# EAGLE design Reader (EAGLE 8.1.0)
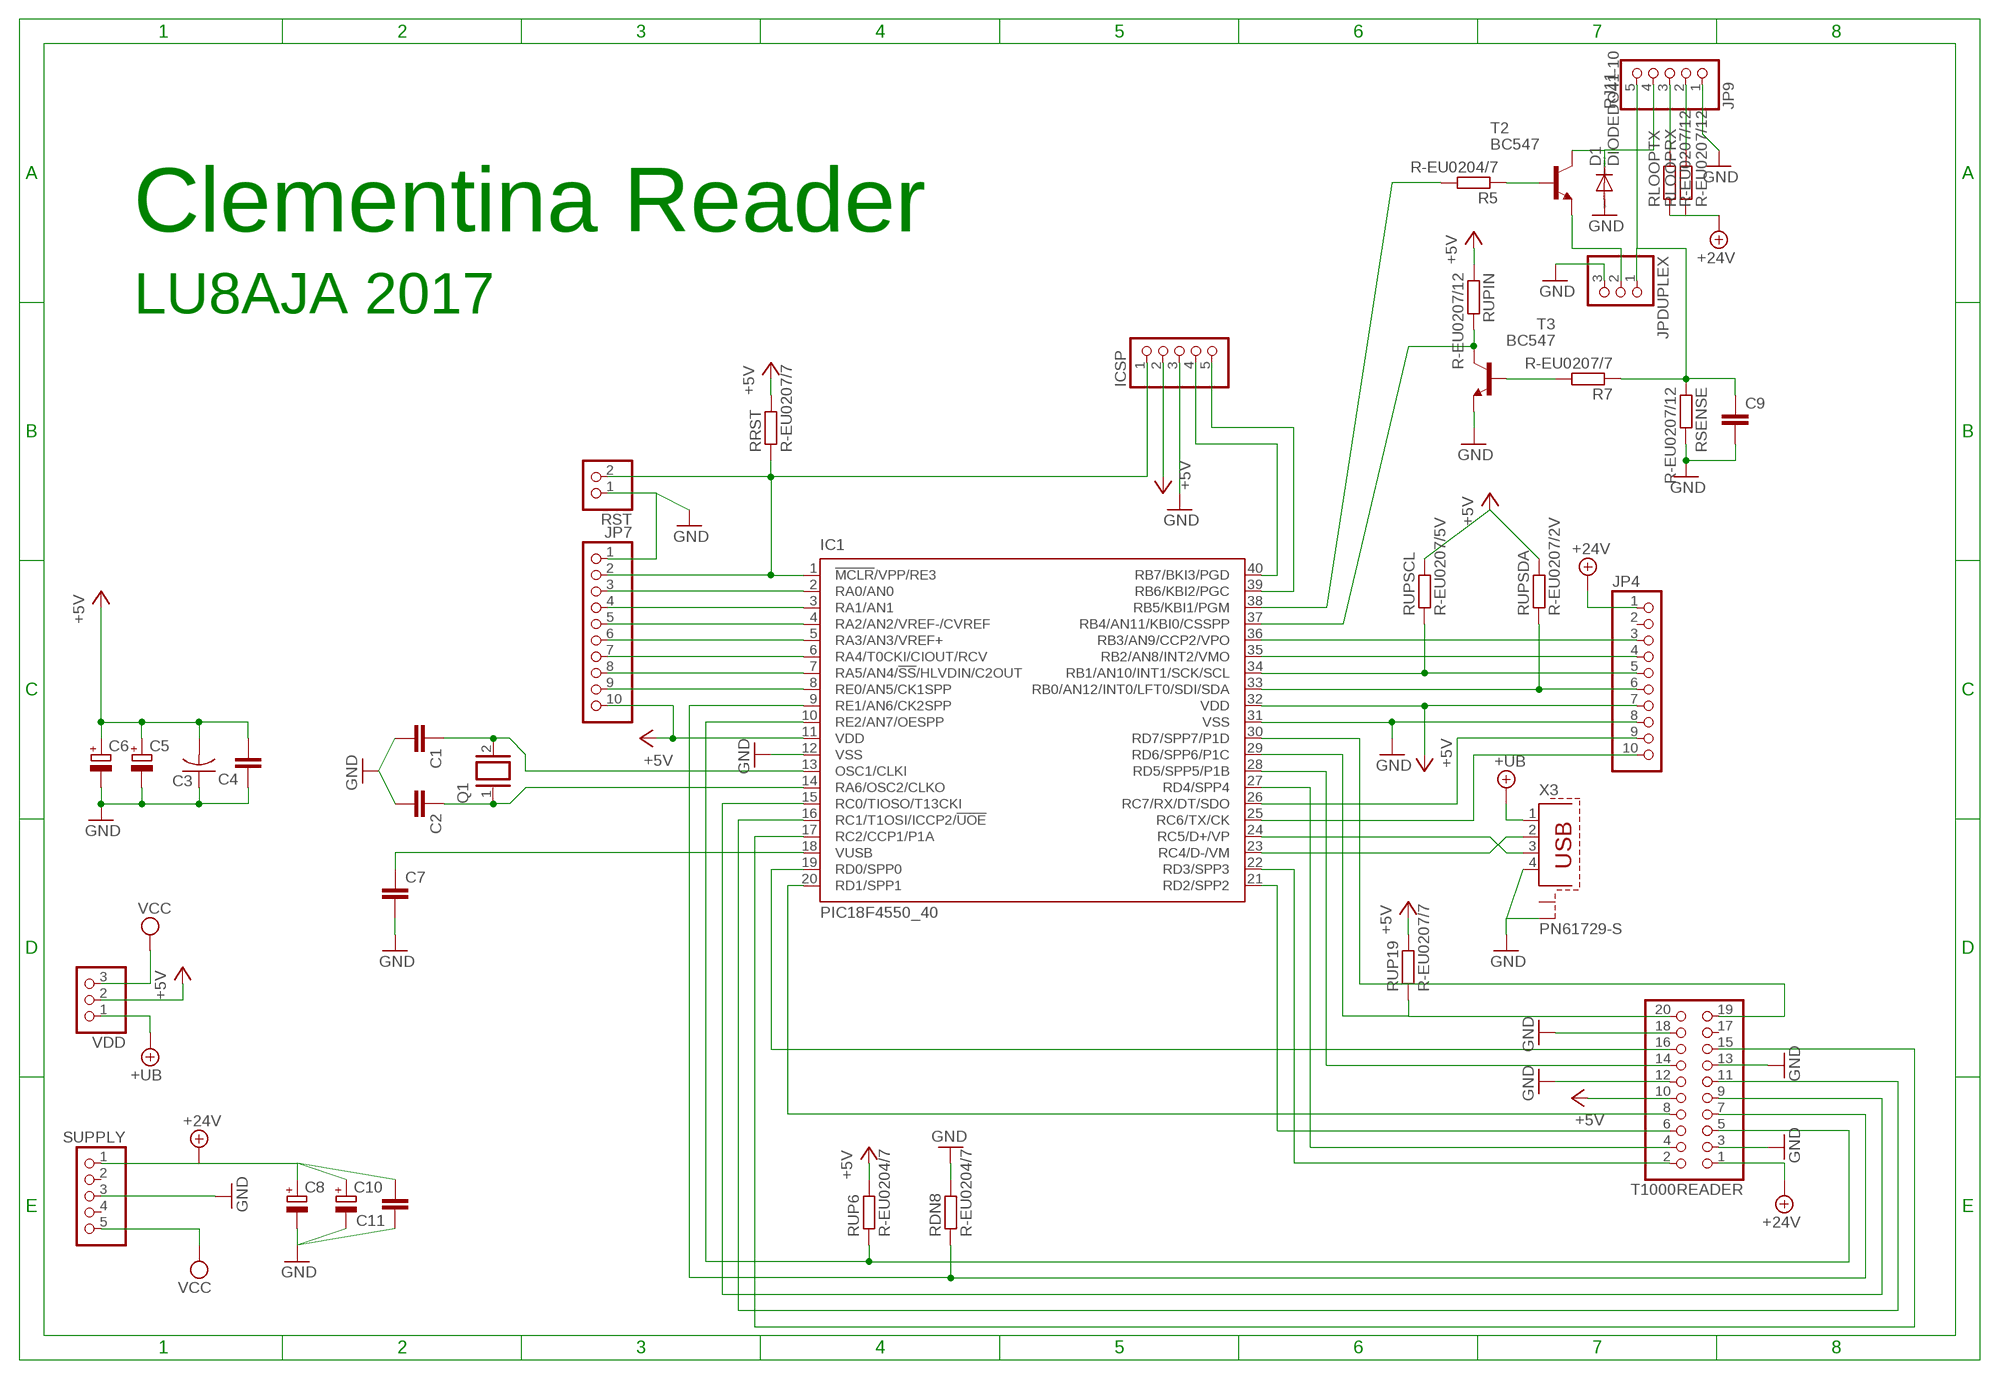
[diagram p0: schematic, sheet 1]

## Parts
C1  C-EU025-025X050  [C025-025X050]
C2  C-EU025-025X050  [C025-025X050]
C3  C-US025-024X044  [C025-024X044]
C4  C-EU025-030X050  [C025-030X050]
C5  CPOL-EUE2.5-6  [E2,5-6]
C6  CPOL-EUE5-8.5  [E5-8,5]
C7  C-EU050-025X075  [C050-025X075]
C8  CPOL-EUE5-8.5  [E5-8,5]
C9  C-EU050-024X044  [C050-024X044]
C10  CPOL-EUE5-8.5  [E5-8,5]
C11  C-EU025-030X050  [C025-030X050]
D1  DIODEDO41-10  [DO41-10]
IC1  PIC18F4550_40  [DIL40]
ICSP  PINHD-1X5  [1X05]
JP4  PINHD-1X10  [1X10]
JP7  PINHD-1X10  [1X10]
JP9  RJ11  PINHD-1X5  [1X05]
JPDUPLEX  PINHD-1X3  [1X03]
Q1  XTAL/S  [QS]
R5  R-EU0204/7  [0204/7]
R7  R-EU0207/7  [0207/7]
RDN8  R-EU0204/7  [0204/7]
RLOOPRX  R-EU0207/12  [0207/12]
RLOOPTX  R-EU0207/12  [0207/12]
RRST  R-EU0207/7  [0207/7]
RSENSE  R-EU0207/12  [0207/12]
RST  PINHD-1X2  [1X02]
RUP6  R-EU0204/7  [0204/7]
RUP19  R-EU0207/7  [0207/7]
RUPIN  R-EU0207/12  [0207/12]
RUPSCL  R-EU0207/5V  [0207/5V]
RUPSDA  R-EU0207/2V  [0207/2V]
SUPPLY  PINHD-1X5  [1X05]
T2  BC547  [TO92]
T3  BC547  [TO92]
T1000READER  PINHD-2X10  [2X10]
VDD  PINHD-1X3  [1X03]
X3  PN61729-S  [PN61729-S]

## Nets
+5V: C3.2 C4.2 C5.+ C6.+ IC1.11(VDD) IC1.32(VDD) ICSP.2 JP4.7 JP7.10 RRST.2 RUP6.2 RUP19.2 RUPIN.1 RUPSCL.2 RUPSDA.2 T1000READER.10 VDD.2
+24V: C8.+ C10.+ C11.2 JP4.1 RLOOPRX.1 RLOOPTX.1 SUPPLY.1 T1000READER.1
+UB: VDD.1 X3.1
GND: C1.2 C2.2 C3.1 C4.1 C5.- C6.- C7.2 C8.- C9.2 C10.- C11.1 D1.A IC1.12(VSS) IC1.31(VSS) ICSP.3 JP4.8 JP7.1 JP9.1 JPDUPLEX.3 RDN8.2 RSENSE.2 RST.1 SUPPLY.3 T3.1(E) T1000READER.3 T1000READER.12 T1000READER.13 T1000READER.18 X3.4 X3.S2
N$1: IC1.21(RD2/SPP2) T1000READER.6
N$2: C2.1 IC1.14(RA6/OSC2/CLKO) Q1.1
N$3: IC1.1(!MCLR!/VPP/RE3) ICSP.1 JP7.2 RRST.1 RST.2
N$4: IC1.15(RC0/TIOSO/T13CKI) T1000READER.9
N$5: IC1.10(RE2/AN7/OESPP) RUP6.1 T1000READER.5
N$6: IC1.9(RE1/AN6/CK2SPP) RDN8.1 T1000READER.7
N$9: IC1.8(RE0/AN5/CK1SPP) JP7.9
N$10: IC1.7(RA5/AN4/!SS!/HLVDIN/C2OUT) JP7.8
N$11: IC1.6(RA4/T0CKI/CIOUT/RCV) JP7.7
N$12: C1.1 IC1.13(OSC1/CLKI) Q1.2
N$13: IC1.5(RA3/AN3/VREF+) JP7.6
N$14: IC1.4(RA2/AN2/VREF-/CVREF) JP7.5
N$15: C7.1 IC1.18(VUSB)
N$17: JP9.3 RLOOPTX.2
N$18: JPDUPLEX.2 T2.1(E)
N$19: JP9.2 RLOOPRX.2
N$20: IC1.27(RD4/SPP4) T1000READER.4
N$21: IC1.22(RD3/SPP3) T1000READER.2
N$22: IC1.17(RC2/CCP1/P1A) T1000READER.15
N$23: IC1.16(RC1/T1OSI/ICCP2/!UOE) T1000READER.11
N$24: IC1.30(RD7/SPP7/P1D) T1000READER.19
N$25: IC1.29(RD6/SPP6/P1C) RUP19.1 T1000READER.20
N$26: IC1.28(RD5/SPP5/P1B) T1000READER.14
N$27: IC1.24(RC5/D+/VP) X3.3
N$28: IC1.3(RA1/AN1) JP7.4
N$30: IC1.36(RB3/AN9/CCP2/VPO) JP4.3
N$31: IC1.33(RB0/AN12/INT0/LFT0/SDI/SDA) JP4.6 RUPSDA.1
N$32: IC1.19(RD0/SPP0) T1000READER.16
N$34: IC1.23(RC4/D-/VM) X3.2
N$35: IC1.20(RD1/SPP1) T1000READER.8
N$37: IC1.25(RC6/TX/CK) JP4.10
N$38: IC1.26(RC7/RX/DT/SDO) JP4.9
N$39: IC1.34(RB1/AN10/INT1/SCK/SCL) JP4.5 RUPSCL.1
N$40: IC1.35(RB2/AN8/INT2/VMO) JP4.4
N$45: IC1.2(RA0/AN0) JP7.3
N$46: IC1.38(RB5/KBI1/PGM) R5.2
N$47: IC1.37(RB4/AN11/KBI0/CSSPP) RUPIN.2 T3.3(C)
N$49: R5.1 T2.2(B)
N$50: D1.C JP9.4 T2.3(C)
N$53: IC1.39(RB6/KBI2/PGC) ICSP.5
N$54: IC1.40(RB7/BKI3/PGD) ICSP.4
N$55: R7.2 T3.2(B)
N$56: C9.1 JP9.5 JPDUPLEX.1 R7.1 RSENSE.1
VCC: SUPPLY.5 VDD.3
Unconnected: JP4.2 SUPPLY.2 SUPPLY.4 T1000READER.17 X3.S1

## Notes on the sheet
- Clementina Reader
- LU8AJA 2017

## Library data of the parts
C1 C2 = rcl:C-EU: CAPACITOR, European symbol
C3 = custom:C-US: CAPACITOR, American symbol
C4 C7 C9 C11 = custom:C-EU: CAPACITOR, European symbol
C5 C8 C10 = custom:CPOL-EU: POLARIZED CAPACITOR, European symbol
C6 = rcl:CPOL-EU: POLARIZED CAPACITOR, European symbol
D1 = custom:DIODE: DIODE general purpose rectifier, 1 A
IC1 = microchip:PIC18F4*_40: USB Microcontrollers with nanoWatt Technology High-Performance, Enhanced Flash, 28/40/44-Pin, Source: http://ww1.microchip.com/downloads/en/devicedoc/39632c.pdf; MF: MICROCHIP; MPN: PIC18F4550-I/P; OC_FARNELL: 9321357; OC_NEWARK: 74K8623
ICSP JP9 SUPPLY = pinhead:PINHD-1X5: PIN HEADER
JP4 JP7 = pinhead:PINHD-1X10: PIN HEADER
JPDUPLEX VDD = pinhead:PINHD-1X3: PIN HEADER
Q1 = special:XTAL/S: CRYSTAL
R5 R7 RDN8 RLOOPRX RLOOPTX RRST RSENSE RUP6 RUP19 RUPIN RUPSCL RUPSDA = custom:R-EU: RESISTOR, European symbol
RST = pinhead:PINHD-1X2: PIN HEADER
T2 T3 = transistor:BC547: NPN TRANSISTOR
T1000READER = pinhead:PINHD-2X10: PIN HEADER
X3 = con-berg:PN61729-S: BERG USB connector; OC_FARNELL: unknown; OC_NEWARK: unknown

## Board
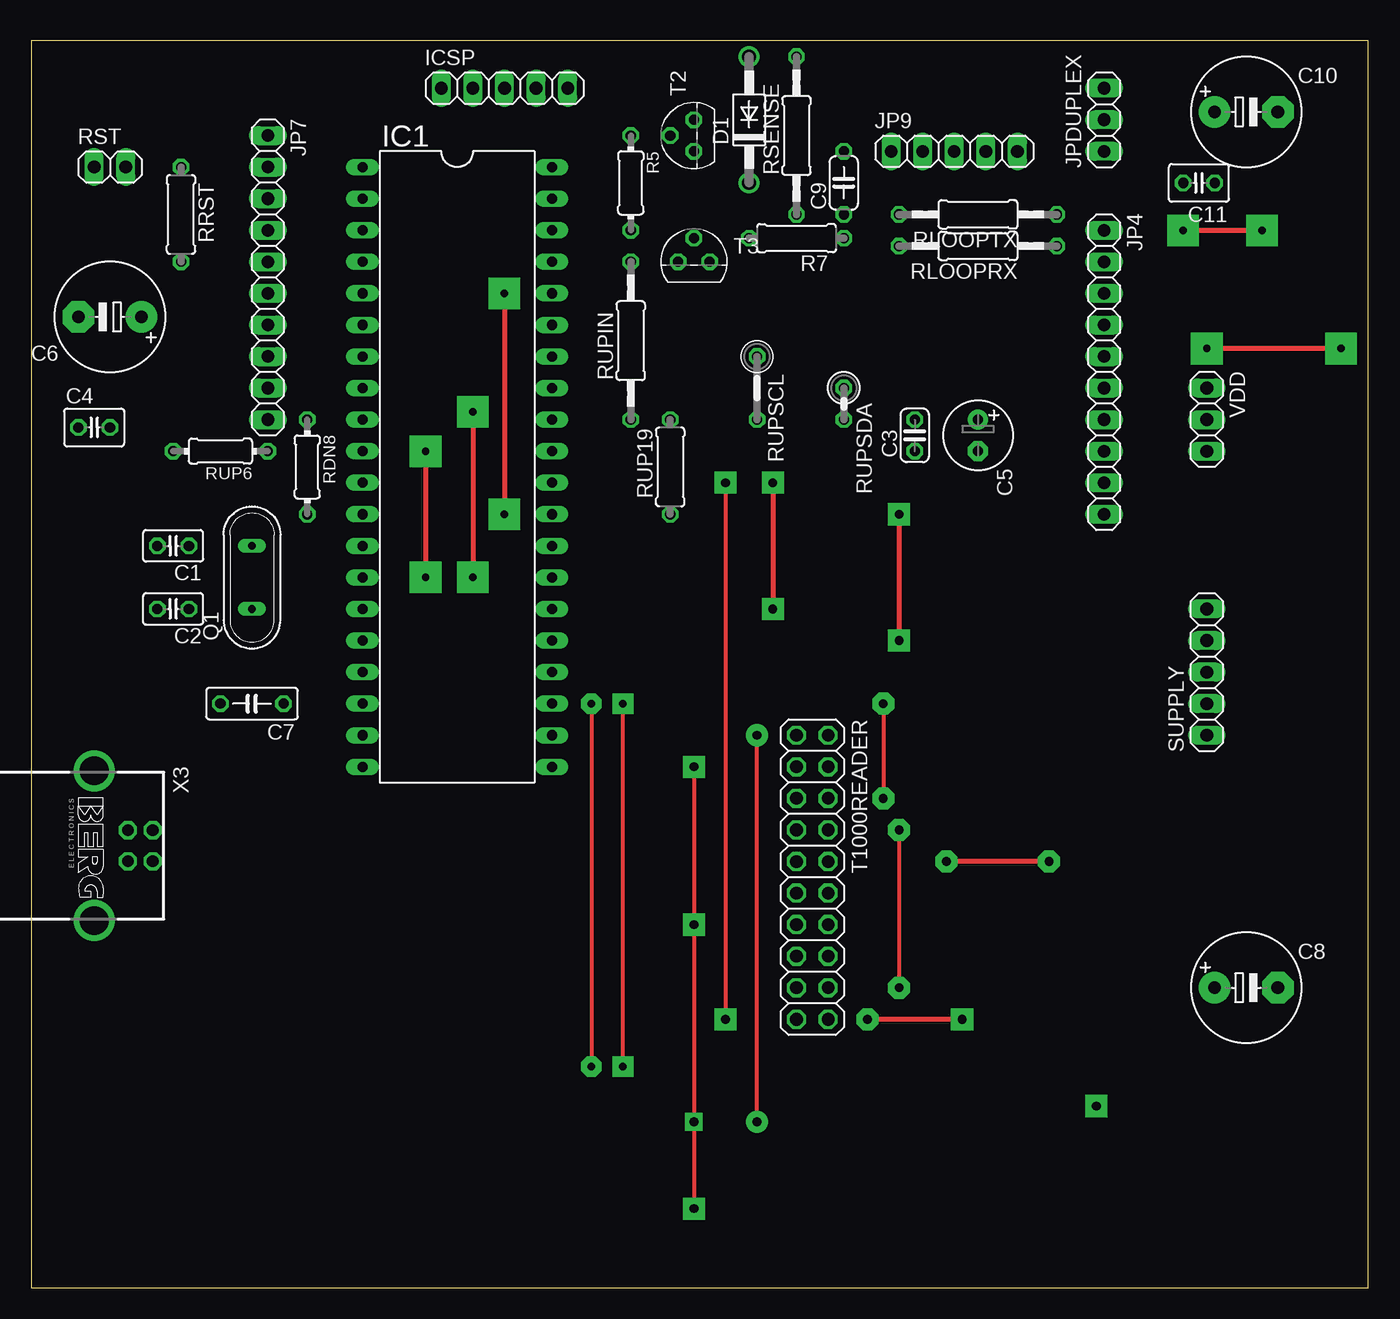
[diagram p1: board, top side]
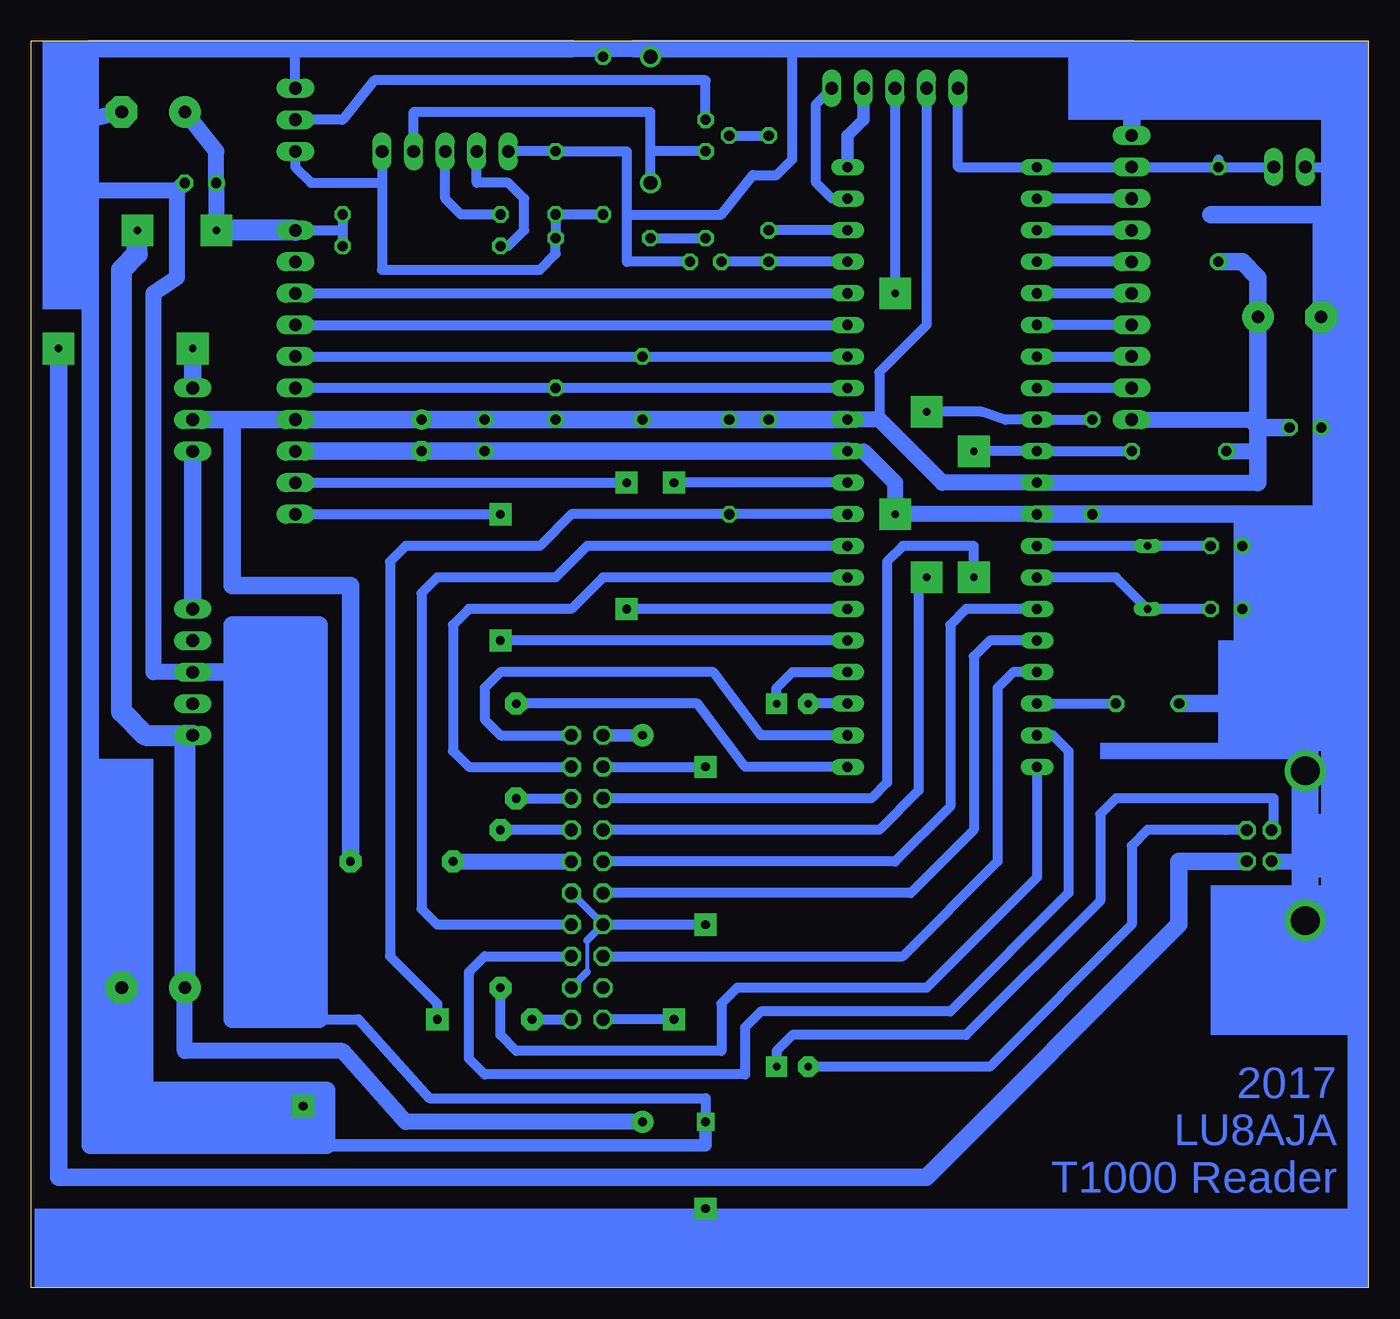
[diagram p2: board, bottom side, seen from below]

Size 107.62 x 100.32 mm. Coordinates in mm from the lower left corner, seen from the top.
Outline: 0,0 107.62,0 107.62,100.32 0,100.32 0,0
Copper layers (1*16): Top 0.035mm / dielectric 1.5mm / Bottom 0.035mm
Design rules "default": minimum track width 10mil, minimum drill 24mil, track to track 8mil, track to pad 8mil, pad to pad 8mil, via to via 8mil, smd to smd 8mil, copper to edge 40mil, drill to drill 8mil, minimum pad ring 10mil, minimum via ring 8mil, stop-mask expansion 4mil, vias tented up to drill 0mil, thermal gap 10mil

### Footprints (pad centres in the part's own frame; a part is rotated, then mirrored left to right if it is on the bottom)
C025-025X050 = drill 0.813 octagon: 1 -1.27,0; 2 1.27,0
C025-024X044 = drill 0.813 octagon: 1 -1.27,0; 2 1.27,0
C025-030X050 = drill 0.813 octagon: 1 -1.27,0; 2 1.27,0
E2,5-6 = drill 0.813 pad 1.6: + -1.27,0 | drill 0.813 pad 1.6 octagon: - 1.27,0
E5-8,5 = drill 1.016 pad 2.54: + -2.54,0 | drill 1.016 pad 2.54 octagon: - 2.54,0
C050-025X075 = drill 0.813 octagon: 1 -2.54,0; 2 2.54,0
C050-024X044 = drill 0.813 octagon: 1 -2.54,0; 2 2.54,0
DO41-10 = drill 1.118: A 5.08,0; C -5.08,0
DIL40 = drill 0.813 long: 1 -24.13,-7.62; 2 -21.59,-7.62; 3 -19.05,-7.62; 4 -16.51,-7.62; 5 -13.97,-7.62; 6 -11.43,-7.62; 7 -8.89,-7.62; 8 -6.35,-7.62; 9 -3.81,-7.62; 10 -1.27,-7.62; 11 1.27,-7.62; 12 3.81,-7.62; 13 6.35,-7.62; 14 8.89,-7.62; 15 11.43,-7.62; 16 13.97,-7.62; 17 16.51,-7.62; 18 19.05,-7.62; 19 21.59,-7.62; 20 24.13,-7.62; 21 24.13,7.62; 22 21.59,7.62; 23 19.05,7.62; 24 16.51,7.62; 25 13.97,7.62; 26 11.43,7.62; 27 8.89,7.62; 28 6.35,7.62; 29 3.81,7.62; 30 1.27,7.62; 31 -1.27,7.62; 32 -3.81,7.62; 33 -6.35,7.62; 34 -8.89,7.62; 35 -11.43,7.62; 36 -13.97,7.62; 37 -16.51,7.62; 38 -19.05,7.62; 39 -21.59,7.62; 40 -24.13,7.62
1X05 = drill 1.016 long: 1 -5.08,0; 2 -2.54,0; 3 0,0; 4 2.54,0; 5 5.08,0
1X10 = drill 1.016 long: 1 -11.43,0; 2 -8.89,0; 3 -6.35,0; 4 -3.81,0; 5 -1.27,0; 6 1.27,0; 7 3.81,0; 8 6.35,0; 9 8.89,0; 10 11.43,0
1X03 = drill 1.016 long: 1 -2.54,0; 2 0,0; 3 2.54,0
QS = drill 0.61 long: 1 -2.54,0; 2 2.54,0
0204/7 = drill 0.813 octagon: 1 -3.81,0; 2 3.81,0
0207/7 = drill 0.813 octagon: 1 -3.81,0; 2 3.81,0
0207/12 = drill 0.813 octagon: 1 -6.35,0; 2 6.35,0
1X02 = drill 1.016 long: 1 -1.27,0; 2 1.27,0
0207/5V = drill 0.813 octagon: 1 -2.54,0; 2 2.54,0
0207/2V = drill 0.813 octagon: 1 -1.27,0; 2 1.27,0
TO92 = drill 0.813 octagon: 1 1.27,0; 2 0,1.905; 3 -1.27,0
2X10 = drill 1.016 octagon: 1 -11.43,-1.27; 2 -11.43,1.27; 3 -8.89,-1.27; 4 -8.89,1.27; 5 -6.35,-1.27; 6 -6.35,1.27; 7 -3.81,-1.27; 8 -3.81,1.27; 9 -1.27,-1.27; 10 -1.27,1.27; 11 1.27,-1.27; 12 1.27,1.27; 13 3.81,-1.27; 14 3.81,1.27; 15 6.35,-1.27; 16 6.35,1.27; 17 8.89,-1.27; 18 8.89,1.27; 19 11.43,-1.27; 20 11.43,1.27
PN61729-S = drill 0.95 octagon: 1 1.25,4.71; 2 -1.25,4.71; 3 -1.25,2.71; 4 1.25,2.71 | drill 2.3 pad 2.9: S1 -6.02,0; S2 6.02,0

### Placement (x,y rotation side)
C1  11.43,59.69 180 top
C2  11.43,54.61 180 top
C3  71.12,68.58 90 top
C4  5.08,69.22 0 top
C5  76.2,68.58 270 top
C6  6.35,78.11 180 top
C7  17.78,46.99 180 top
C8  97.79,24.13 0 top
C9  65.41,88.9 90 top
C10  97.79,94.62 0 top
C11  93.98,88.9 180 top
D1  57.78,93.98 90 top
IC1  34.29,66.04 270 top
ICSP  38.1,96.52 0 top
JP4  86.36,73.66 270 top
JP7  19.05,81.28 270 top
JP9  74.3,91.44 0 top
JPDUPLEX  86.36,93.98 90 top
Q1  17.78,57.15 90 top
R5  48.26,88.9 270 top
R7  61.59,84.45 180 top
RDN8  22.23,66.04 270 top
RLOOPRX  76.2,83.82 180 top
RLOOPTX  76.2,86.36 180 top
RRST  12.07,86.36 270 top
RSENSE  61.59,92.71 90 top
RST  6.35,90.17 0 top
RUP6  15.24,67.31 180 top
RUP19  51.43,66.04 90 top
RUPIN  48.26,76.2 90 top
RUPSCL  58.42,72.39 270 top
RUPSDA  65.41,71.12 270 top
SUPPLY  94.62,49.53 90 top
T2  53.34,92.71 90 top
T3  53.34,82.55 0 top
T1000READER  62.87,33.02 270 top
VDD  94.62,69.85 270 top
X3  5.08,35.56 270 top

### Tracks (layer width: path | path; a pad name or v marks a point on that pad's centre or on a via)
+5V  (via drill 0.7 pad 1.78)
  Top 0.406: v81.92,34.29 v73.66,34.29
  Bottom 0.813: ICSP.2 35.56,77.47 39.37,73.66 39.37,69.85
  Bottom 1.27: IC1.32 39.37,69.85 34.29,64.77 IC1.11 8.89,64.77 | RUP6.2 8.89,67.31 | JP7.10 9.53,69.85 8.89,69.22 | v73.66,34.29 T1000READER.10
  Bottom 1.422: 8.89,69.22 C6.+ 8.89,81.28 10.16,82.55 RRST.2 | IC1.32 RUPIN.1 RUP19.2 RUPSCL.2 RUPSDA.2 C3.2 C5.+ JP4.7 91.44,69.85 | 8.89,64.77 8.89,67.31 8.89,69.22 | C4.2 8.89,69.22 | 91.44,69.85 VDD.2 | v81.92,34.29 81.92,56.52 91.44,56.52 91.44,69.85
+24V  (via drill 0.6 pad 2.54, 0.7 pad 1.78)
  Top 0.305: v58.42,13.33 v58.42,44.45
  Top 0.406: v92.71,85.09 v99.06,85.09
  Bottom 0.813: JP4.1 82.55,85.09 | 82.55,85.09 RLOOPRX.1 | RLOOPTX.1 82.55,85.09
  Bottom 1.016: v58.42,44.45 T1000READER.1
  Bottom 1.27: C8.+ 95.25,19.05 82.55,19.05 77.47,13.33 v58.42,13.33 | C10.+ 92.71,91.44 C11.2 v92.71,85.09
  Bottom 1.676: JP4.1 v92.71,85.09 | v99.06,85.09 99.06,83.19 100.33,81.92 100.33,46.36 98.42,44.45 SUPPLY.1 95.25,44.45 C8.+
+UB  (via drill 0.6 pad 2.54)
  Top 0.406: v105.41,75.56 v94.62,75.56
  Bottom 1.422: X3.1 11.71,34.29 15.24,34.29 15.24,29.21 35.56,8.89 105.41,8.89 v105.41,75.56 | VDD.1 v94.62,75.56
GND  (via drill 0.6 pad 2.54, 0.7 pad 1.42, 0.7 pad 1.78)
  Top 0.305: v53.34,41.91 v53.34,29.21 v53.34,13.33 v53.34,6.35
  Top 0.406: v38.1,80.01 v38.1,62.23
  Bottom 0.305: 62.87,27.94 62.87,25.4
  Bottom 0.61: 62.87,27.94 T1000READER.13 T1000READER.12 | 62.87,25.4 T1000READER.18
  Bottom 0.813: RST.1 3.18,90.17 3.18,87 3.81,86.36 | ICSP.3 v38.1,80.01 | T3.1 59.69,82.55 59.69,86.36 | 5.08,44.45 5.71,43.81 | 59.69,86.36 52.07,86.36 49.53,89.53 47.62,89.53 46.35,90.81 46.35,99.7 | 59.69,86.36 59.69,91.44 C9.2 JP9.1 | 61.59,99.7 57.78,99.7 D1.A | RSENSE.2 61.59,99.7 | 61.59,99.7 64.14,99.7 | JPDUPLEX.3 86.36,99.7 | v53.34,6.35 53.34,5.08 1.27,5.71 1.27,29.84 X3.S2 | T1000READER.3 v53.34,41.91 | T1000READER.13 v53.34,29.21 | 84.45,21.59 81.28,21.59 75.56,15.24 53.34,15.24 v53.34,13.33 | v85.73,14.61 83.82,11.43
  Bottom 1.016: 40.64,67.31 IC1.31 | v53.34,13.33 53.34,11.43 83.82,11.43
  Bottom 1.27: 93.98,49.53 SUPPLY.3 97.79,49.53 97.79,80.01 95.89,81.28 95.89,88.27 | X3.4 7.77,34.29 5.08,34.29 | 5.08,29.21 X3.S2 | 40.64,67.31 38.1,64.77 v38.1,62.23 IC1.12 | 95.89,88.27 102.87,88.27 | C10.- 102.87,93.98 | C11.1 95.89,88.27
  Bottom 1.422: 10.16,62.23 3.81,62.23 C4.1 C6.- 3.81,86.36 12.7,86.36 | 10.16,62.23 C1.2 C2.2 10.16,46.99 C7.2 | IC1.12 RDN8.2 10.16,62.23 | 3.81,99.06 19.05,99.7 | 19.05,99.7 46.35,99.7 57.78,99.7 59.05,99.7 | 64.14,99.7 86.36,99.7 102.87,99.7 102.87,93.98 102.87,88.27 102.87,24.13 | JP7.1 19.05,99.7 | 102.87,24.13 C8.- | 102.87,24.13 102.87,15.88 | 102.87,15.88 83.82,15.88 83.82,11.43 102.87,11.43 102.87,15.88 | SUPPLY.3 91.44,49.53 | IC1.31 C3.1 C5.- JP4.8 | 91.44,49.53 91.44,53.34 84.45,53.34 84.45,21.59 91.44,21.59 91.44,49.53
  Bottom 2.184: X3.S2 5.08,34.29 5.08,44.45 5.08,46.99 10.16,46.99
N$1  (via drill 0.7 pad 1.78)
  Top 0.305: v68.58,46.99 v68.58,39.37
  Bottom 0.813: IC1.21 50.16,41.91 53.97,46.99 v68.58,46.99 | v68.58,39.37 T1000READER.6
N$2
  Bottom 0.813: C2.1 Q1.1 20.32,57.15 IC1.14
N$3
  Bottom 0.813: RRST.1 12.07,90.81 | RRST.1 RST.2 | RRST.1 JP7.2 IC1.1 33.02,90.17 ICSP.1
N$4
  Bottom 0.813: IC1.15 32.38,54.61 33.65,53.34 33.65,38.73 38.1,34.29 T1000READER.9
N$5  (via drill 0.6 pad 2.54)
  Top 0.406: v31.75,67.31 v31.75,57.15
  Bottom 0.813: v31.75,67.31 IC1.10 RUP6.1 | v31.75,57.15 31.75,59.69 37.46,59.69 38.73,58.42 38.73,40.64 40,39.37 T1000READER.5
N$6  (via drill 0.6 pad 2.54)
  Top 0.406: v35.56,70.48 v35.56,57.15
  Bottom 0.813: v35.56,70.48 31.11,70.48 29.21,69.85 IC1.9 RDN8.1 | v35.56,57.15 36.2,56.52 36.2,40 39.37,36.83 T1000READER.7
N$9
  Bottom 0.813: JP7.9 IC1.8
N$10
  Bottom 0.813: IC1.7 JP7.8
N$11
  Bottom 0.813: JP7.7 IC1.6
N$12
  Bottom 0.813: C1.1 Q1.2 IC1.13
N$13
  Bottom 0.813: IC1.5 JP7.6
N$14
  Bottom 0.813: JP7.5 IC1.4
N$15
  Bottom 0.813: IC1.18 C7.1
N$17
  Bottom 0.813: RLOOPTX.2 73.03,86.36 74.3,87.63 JP9.3
N$18
  Bottom 0.813: T2.1 53.34,97.16 80.01,97.16 82.55,93.98 JPDUPLEX.2
N$19
  Bottom 0.813: RLOOPRX.2 69.22,83.82 67.95,85.09 67.95,87.63 69.22,88.9 71.76,88.9 JP9.2
N$20
  Bottom 0.813: IC1.27 61.59,57.15 64.14,54.61 72.39,54.61 73.66,53.34 73.66,43.18 72.39,41.91 T1000READER.4
N$21
  Bottom 0.813: IC1.22 48.89,44.45 52.7,49.53 69.85,49.53 71.12,48.26 71.12,45.72 69.85,44.45 T1000READER.2
N$22
  Bottom 0.813: IC1.17 28.57,49.53 29.84,48.26 29.84,34.29 37.46,26.67 T1000READER.15
N$23
  Bottom 0.813: IC1.16 30.48,52.07 31.75,50.8 31.75,36.83 36.83,31.75 T1000READER.11
N$24  (via drill 0.7 pad 1.78)
  Top 0.305: v55.88,64.77 v55.88,21.59
  Bottom 0.813: IC1.30 v55.88,64.77 | v55.88,21.59 T1000READER.19
N$25  (via drill 0.7 pad 1.78)
  Top 0.406: v74.93,21.59 v67.31,21.59
  Bottom 0.813: IC1.29 RUP19.1 64.14,62.23 66.67,59.69 77.47,59.69 78.74,58.42 78.74,26.67 74.93,22.86 v74.93,21.59 | v67.31,21.59 T1000READER.20
N$26
  Bottom 0.813: IC1.28 62.87,59.69 65.41,57.15 74.93,57.15 76.2,55.88 76.2,30.48 74.93,29.21 T1000READER.14
N$27  (via drill 0.6 pad 1.68)
  Top 0.305: v47.62,17.78 v47.62,46.99
  Bottom 0.813: X3.3 7.62,36.98 7.62,39.37 20.32,39.37 21.59,38.1 21.59,31.12 32.38,20.32 46.35,20.32 47.62,19.05 v47.62,17.78 | v47.62,46.99 47.62,48.26 46.35,49.53 IC1.24
N$28
  Bottom 0.813: IC1.3 JP7.4
N$30
  Bottom 0.813: JP4.3 IC1.36
N$31
  Bottom 0.813: IC1.33 RUPSDA.1 JP4.6
N$32
  Bottom 0.813: IC1.19 25.4,44.45 24.13,43.18 24.13,31.75 33.65,22.23 48.89,22.23 50.16,20.95 50.16,17.14 71.12,17.14 72.39,18.41 72.39,25.4 71.12,26.67 T1000READER.16
N$34  (via drill 0.6 pad 1.68)
  Top 0.305: v45.08,46.99 v45.08,17.78
  Bottom 0.813: IC1.23 v45.08,46.99 | X3.2 11.45,36.81 13.34,36.83 17.78,36.83 19.05,35.56 19.05,29.21 30.48,17.78 v45.08,17.78
N$35  (via drill 0.7 pad 1.78)
  Top 0.305: v69.85,36.83 v69.85,24.13
  Bottom 0.813: IC1.20 26.67,33.02 35.56,24.13 50.8,24.13 52.07,22.86 52.07,19.05 68.58,19.05 69.85,20.32 v69.85,24.13 | T1000READER.8 v69.85,36.83
N$37  (via drill 0.7 pad 1.78)
  Top 0.406: v69.85,62.23 v69.85,52.07
  Bottom 0.813: JP4.10 v69.85,62.23 | IC1.25 v69.85,52.07
N$38  (via drill 0.7 pad 1.78)
  Top 0.406: v59.69,64.77 v59.69,54.61
  Bottom 0.813: JP4.9 v59.69,64.77 | IC1.26 v59.69,54.61
N$39
  Bottom 0.813: JP4.5 RUPSCL.1 IC1.34
N$40
  Bottom 0.813: JP4.4 IC1.35
N$45
  Bottom 0.813: JP7.3 IC1.2
N$46
  Bottom 0.813: IC1.38 R5.2
N$47
  Bottom 0.813: IC1.37 RUPIN.2 T3.3
N$49
  Bottom 0.813: T2.2 R5.1
N$50
  Bottom 0.813: D1.C 57.78,91.44 | 57.78,91.44 57.78,94.62 76.84,94.62 JP9.4 | T2.3 57.78,91.44
N$53
  Bottom 0.813: IC1.39 43.18,87.63 44.45,88.9 44.45,95.25 ICSP.5
N$54
  Bottom 1.016: ICSP.4 40.64,93.98 41.91,92.71 IC1.40
N$55
  Bottom 0.813: R7.2 T3.2
N$56
  Bottom 0.813: RSENSE.1 C9.1 R7.1 65.41,83.19 66.67,81.92 79.38,81.92 79.38,88.9 | JPDUPLEX.1 86.36,90.17 85.09,88.9 79.38,88.9 | JP9.5 79.38,88.9
VCC
  Bottom 1.422: VDD.3 SUPPLY.5
(copper drawn outside any net)
  shapes: Bottom area x16

### Text on the board
Bottom: 2017 / LU8AJA / T1000 Reader